# Altium project Master_uC_PCB.PrjPcb (part 2 of 2)

## Sheet [5]Cooling_Control.SchDoc
size A4; SheetNumber: 6; SheetTotal: 6
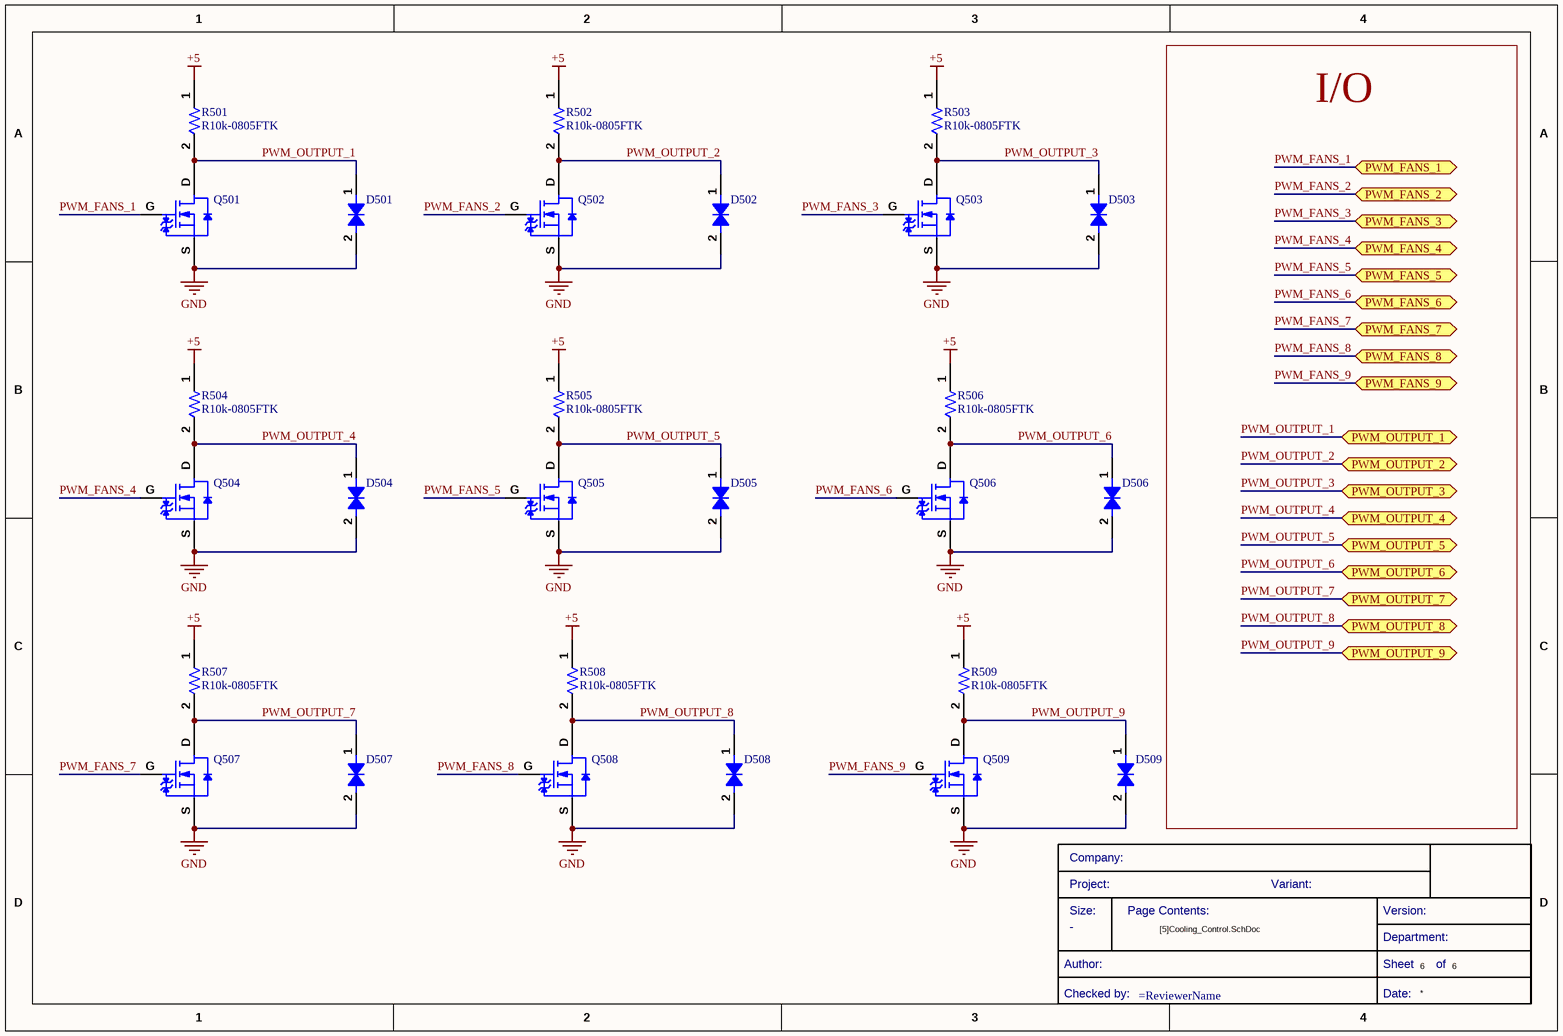
[diagram p4: [5]Cooling_Control.SchDoc]

### Parts
(Parts that share a designator on the sheet are numbered #1, #2 ... from top to bottom, then left to right.)
?#5  (no value)  (graphical)
D501  DTVS-13V-DO-214AC  [DTVS-DO-214AC]  (value not drawn)
D502  DTVS-13V-DO-214AC  [DTVS-DO-214AC]  (value not drawn)
D503  DTVS-13V-DO-214AC  [DTVS-DO-214AC]  (value not drawn)
D504  DTVS-13V-DO-214AC  [DTVS-DO-214AC]  (value not drawn)
D505  DTVS-13V-DO-214AC  [DTVS-DO-214AC]  (value not drawn)
D506  DTVS-13V-DO-214AC  [DTVS-DO-214AC]  (value not drawn)
D507  DTVS-13V-DO-214AC  [DTVS-DO-214AC]  (value not drawn)
D508  DTVS-13V-DO-214AC  [DTVS-DO-214AC]  (value not drawn)
D509  DTVS-13V-DO-214AC  [DTVS-DO-214AC]  (value not drawn)
Q501  SQ2318CES-T1_GE3  [SOT95P245X110-3N]  (value not drawn)
Q502  SQ2318CES-T1_GE3  [SOT95P245X110-3N]  (value not drawn)
Q503  SQ2318CES-T1_GE3  [SOT95P245X110-3N]  (value not drawn)
Q504  SQ2318CES-T1_GE3  [SOT95P245X110-3N]  (value not drawn)
Q505  SQ2318CES-T1_GE3  [SOT95P245X110-3N]  (value not drawn)
Q506  SQ2318CES-T1_GE3  [SOT95P245X110-3N]  (value not drawn)
Q507  SQ2318CES-T1_GE3  [SOT95P245X110-3N]  (value not drawn)
Q508  SQ2318CES-T1_GE3  [SOT95P245X110-3N]  (value not drawn)
Q509  SQ2318CES-T1_GE3  [SOT95P245X110-3N]  (value not drawn)
R501  R10k-0805FTK  [R0805FTK]
R502  R10k-0805FTK  [R0805FTK]
R503  R10k-0805FTK  [R0805FTK]
R504  R10k-0805FTK  [R0805FTK]
R505  R10k-0805FTK  [R0805FTK]
R506  R10k-0805FTK  [R0805FTK]
R507  R10k-0805FTK  [R0805FTK]
R508  R10k-0805FTK  [R0805FTK]
R509  R10k-0805FTK  [R0805FTK]

### Ports
PWM_FANS_1 (bidir, see Master_uC_PCB.SchDoc[1C], [2]STM32L4[3A]), PWM_FANS_2 (bidir, see Master_uC_PCB.SchDoc[1C], [2]STM32L4[3A]), PWM_FANS_3 (bidir, see Master_uC_PCB.SchDoc[1C], [2]STM32L4[3A]), PWM_FANS_4 (bidir, see Master_uC_PCB.SchDoc[1C], [2]STM32L4[3B]), PWM_FANS_5 (bidir, see Master_uC_PCB.SchDoc[1C], [2]STM32L4[3B]), PWM_FANS_6 (bidir, see Master_uC_PCB.SchDoc[1C], [2]STM32L4[3B]), PWM_FANS_7 (bidir, see Master_uC_PCB.SchDoc[1C], [2]STM32L4[3B]), PWM_FANS_8 (bidir, see Master_uC_PCB.SchDoc[1C], [2]STM32L4[3B]), PWM_FANS_9 (bidir, see Master_uC_PCB.SchDoc[1C], [2]STM32L4[3B]), PWM_OUTPUT_1 (bidir, see Master_uC_PCB.SchDoc[1C]), PWM_OUTPUT_2 (bidir, see Master_uC_PCB.SchDoc[1C]), PWM_OUTPUT_3 (bidir, see Master_uC_PCB.SchDoc[1C]), PWM_OUTPUT_4 (bidir, see Master_uC_PCB.SchDoc[1C]), PWM_OUTPUT_5 (bidir, see Master_uC_PCB.SchDoc[1C]), PWM_OUTPUT_6 (bidir, see Master_uC_PCB.SchDoc[1C]), PWM_OUTPUT_7 (bidir, see Master_uC_PCB.SchDoc[1C]), PWM_OUTPUT_8 (bidir, see Master_uC_PCB.SchDoc[1C]), PWM_OUTPUT_9 (bidir, see Master_uC_PCB.SchDoc[1C])

### Nets
+5: R501.1 R502.1 R503.1 R504.1 R505.1 R506.1 R507.1 R508.1 R509.1
GND: D501.2 D502.2 D503.2 D504.2 D505.2 D506.2 D507.2 D508.2 D509.2 Q501.S Q502.S Q503.S Q504.S Q505.S Q506.S Q507.S Q508.S Q509.S
PWM_FANS_1: Q501.G ; port PWM_FANS_1
PWM_FANS_2: Q502.G ; port PWM_FANS_2
PWM_FANS_3: Q503.G ; port PWM_FANS_3
PWM_FANS_4: Q504.G ; port PWM_FANS_4
PWM_FANS_5: Q505.G ; port PWM_FANS_5
PWM_FANS_6: Q506.G ; port PWM_FANS_6
PWM_FANS_7: Q507.G ; port PWM_FANS_7
PWM_FANS_8: Q508.G ; port PWM_FANS_8
PWM_FANS_9: Q509.G ; port PWM_FANS_9
PWM_OUTPUT_1: D501.1 Q501.D R501.2 ; port PWM_OUTPUT_1
PWM_OUTPUT_2: D502.1 Q502.D R502.2 ; port PWM_OUTPUT_2
PWM_OUTPUT_3: D503.1 Q503.D R503.2 ; port PWM_OUTPUT_3
PWM_OUTPUT_4: D504.1 Q504.D R504.2 ; port PWM_OUTPUT_4
PWM_OUTPUT_5: D505.1 Q505.D R505.2 ; port PWM_OUTPUT_5
PWM_OUTPUT_6: D506.1 Q506.D R506.2 ; port PWM_OUTPUT_6
PWM_OUTPUT_7: D507.1 Q507.D R507.2 ; port PWM_OUTPUT_7
PWM_OUTPUT_8: D508.1 Q508.D R508.2 ; port PWM_OUTPUT_8
PWM_OUTPUT_9: D509.1 Q509.D R509.2 ; port PWM_OUTPUT_9

### Notes on the sheet
- I/O
- Size:
- Company:
- Project:
- Page Contents:
- Variant:
- Version:
- Checked by:
- Author:
- Sheet
- Date:
- Department:
- of

### Library data of the parts
?#5 = CMP-00043-6: Standard Title Block
D501-D509 = CMP-00155-1: Tvs Diode, 400W, 13V, Bidir, DO-214AC; Manufacturer Part Number: 824501131; Manufacturer: Wurth Electronics; Peak Pulse Current: 18.6A; Power Line Protection: No; .Creator: DO; Forward Voltage: 15.15V; Polarity: Bidirectional; Number of Bidirectional Channels: 1; Clamping Voltage: 21.5V; Max Operating Temperature: 150°C; Category: TVS Diodes; Stock 1: 1000; RoHS: Yes; ComponentLink3Description: Where buy it; Source: Filter components.SchLib; Design Item ID: DTVS-13V-DO-214AC; REACH SVHC: Unknown; Min Operating Temperature: -65°C; Resistor Type: Zener; ComponentLink2Description: http://www.farnell.com/datasheets/2036399.pdf?src-supplier=Element14; Peak Pulse Power: 400W; ComponentLink1URL: https://katalog.we-online.de/pbs/datasheet/824501131.pdf?src-supplier=Digi-Key; Packaging: Cut Tape; ComponentLink2URL: http://www.farnell.com/datasheets/2036399.pdf?src-supplier=Element14; ComponentLink3URL: https://www.we-online.com/catalog/en/WE-TVSP?sq=824501131#824501131; RoHS Compliant: Yes; Reverse Standoff Voltage: 13V; Mount: Surface Mount; Min Breakdown Voltage: 15.15V; ComponentLink1Description: https://katalog.we-online.de/pbs/datasheet/824501131.pdf?src-supplier=Digi-Key; Pricing 1: 1=0,27000 (USD); Pins: 2
Q501-Q509 = CMP-013-00002-1: Mosfet, N-channel, 40V, 7A, SOT-23 Rohs Compliant: Yes
R501-R509 = CMP-00085-1: BOURNS         CR0805-JW-103ELF            Surface Mount Chip Resistor, Thick Film, CR Series, 10 kohm, 125 mW,  5%, 150 V; .Creator: DR; Power Rating: 125mW; Voltage Rating (DC): 100V; Voltage Rating: 150V; Temperature Coefficient: 200ppm/°C; Value: 10k; ComponentLink6URL: https://datasheet.ciiva.com/16783/70154685-16783482.pdf?src-supplier=Allied+Electronics; Manufacturer 1: Bourns; Package Quantity: 1; ComponentLink10URL: https://datasheet.ciiva.com/7985/1856384-7985869.pdf?src-supplier=Element14; Technology: THICK FILM; Source: Passives.SchLib; RoHS Compliant: Yes; ComponentLink10Description: https://datasheet.ciiva.com/7985/1856384-7985869.pdf?src-supplier=Element14; ComponentLink1URL: https://datasheet.ciiva.com/11821/0900766b80fcdb72-11821135.pdf?src-supplier=RSComponents; ComponentLink7Description: https://datasheet.ciiva.com/5548/chpreztr-5548491.pdf?src-supplier=Mouser; Radiation Hardening: No; Design Item ID: R10k-0805FTK; ComponentLink4Description: https://datasheet.ciiva.com/7986/691949-7986187.pdf?src-supplier=Element14; Pins: 2; ComponentLink9URL: https://datasheet.ciiva.com/6559/chpreztr-6559901.pdf?src-supplier=Digi-Key; Resistor Type: Thick Film; ComponentLink4URL: https://datasheet.ciiva.com/7986/691949-7986187.pdf?src-supplier=Element14; Contact Plating: Tin; Case Code (Metric): 2012; Military Standard: Not; Depth: 1.25mm; Case/Package: 0805; Packaging: Tape and Reel; ComponentLink9Description: https://datasheet.ciiva.com/6559/chpreztr-6559901.pdf?src-supplier=Digi-Key; Construction: Rectangular; Pricing 1: 1=0,05790, 10=0,01540, 25=0,01340, 100=0,00340 (USD); ComponentLink7URL: https://datasheet.ciiva.com/5548/chpreztr-5548491.pdf?src-supplier=Mouser; Category: Chip SMD Resistors; Length: 2mm; Max Operating Temperature: 155°C; Resistance Tolerance: 5%; Manufacturer Part Number 1: CR0805-JW-103ELF; Height: 0.5mm; ComponentLink2URL: https://datasheet.ciiva.com/9122/chpreztr-9122374.pdf?src-supplier=Avnet; Thickness: 508um; Max Power Dissipation: 125mW; ComponentLink8Description: https://datasheet.ciiva.com/6559/chpreztr-6559900.pdf?src-supplier=Digi-Key; REACH SVHC: No SVHC; ComponentLink8URL: https://datasheet.ciiva.com/6559/chpreztr-6559900.pdf?src-supplier=Digi-Key; ComponentLink5URL: https://datasheet.ciiva.com/30065/159chpreztr-30065976.pdf?src-supplier=Onlinecomponents.com; Width: 1.25mm; ComponentLink11URL: https://datasheet.ciiva.com/48692/001055517-da-01-en-smd-wid-cr0805-jw-103elf-10k-ohm-1-8w-48692118.pdf?src-supplier=Conrad; ComponentLink3Description: https://datasheet.ciiva.com/22693/1902866-22693254.pdf?src-supplier=Element14; ComponentLink11Description: https://datasheet.ciiva.com/48692/001055517-da-01-en-smd-wid-cr0805-jw-103elf-10k-ohm-1-8w-48692118.pdf?src-supplier=Conrad; ComponentLink1Description: https://datasheet.ciiva.com/11821/0900766b80fcdb72-11821135.pdf?src-supplier=RSComponents; ComponentLink2Description: https://datasheet.ciiva.com/9122/chpreztr-9122374.pdf?src-supplier=Avnet; Stock 1: 57566; Min Operating Temperature: -55°C; Series: CR0805; Number of Terminations: 2; Termination: SMD/SMT; Tolerance: 5%; Mount: Surface Mount; ComponentLink6Description: https://datasheet.ciiva.com/16783/70154685-16783482.pdf?src-supplier=Allied+Electronics; ComponentLink5Description: https://datasheet.ciiva.com/30065/159chpreztr-30065976.pdf?src-supplier=Onlinecomponents.com; RoHS: Yes; Features: Moisture Resistant; ComponentLink3URL: https://datasheet.ciiva.com/22693/1902866-22693254.pdf?src-supplier=Element14

## Nets that join several sheets
+3V3: [1]Supply (C*#5.2 R*#1.2 U?.2 U?.4), [2]STM32L4 (14 pins), [3]CAN_Communication (C301.1 U301.11), [4]isoSPI (U401.1 U401.6 U401.25 U401.30)
+5: [1]Supply (C*#3.2 C*#4.2 DCDC*.3 U?.3), [4]isoSPI (6 pins), [5]Cooling_Control (9 pins)
GND: [1]Supply (7 pins), [2]STM32L4 (19 pins), [3]CAN_Communication (15 pins), [4]isoSPI (8 pins), [5]Cooling_Control (18 pins)
CAN1_RX: [2]STM32L4 (U201.70), [3]CAN_Communication (U301.4)
CAN1_TX: [2]STM32L4 (U201.71), [3]CAN_Communication (U301.1)
CAN2_RX: [2]STM32L4 (U201.51), [3]CAN_Communication (U301.7)
CAN2_TX: [2]STM32L4 (U201.52), [3]CAN_Communication (U301.6)
PWM_FANS_1: [2]STM32L4 (U201.15), [5]Cooling_Control (Q501.G)
PWM_FANS_2: [2]STM32L4 (U201.16), [5]Cooling_Control (Q502.G)
PWM_FANS_3: [2]STM32L4 (U201.17), [5]Cooling_Control (Q503.G)
PWM_FANS_4: [2]STM32L4 (U201.18), [5]Cooling_Control (Q504.G)
PWM_FANS_5: [2]STM32L4 (U201.33), [5]Cooling_Control (Q505.G)
PWM_FANS_6: [2]STM32L4 (U201.34), [5]Cooling_Control (Q506.G)
PWM_FANS_7: [2]STM32L4 (U201.63), [5]Cooling_Control (Q507.G)
PWM_FANS_8: [2]STM32L4 (U201.64), [5]Cooling_Control (Q508.G)
PWM_FANS_9: [2]STM32L4 (U201.65), [5]Cooling_Control (Q509.G)
SPI1_CS: [2]STM32L4 (U201.67), [4]isoSPI (U401.5)
SPI1_PICO: [2]STM32L4 (U201.32), [4]isoSPI (U401.2)
SPI1_POCI: [2]STM32L4 (U201.31), [4]isoSPI (U401.3)
SPI1_SCK: [2]STM32L4 (U201.30), [4]isoSPI (U401.4)
SPI2_PICO: [2]STM32L4 (U201.54), [4]isoSPI (U401.26)
SPI2_POCI: [2]STM32L4 (U201.53), [4]isoSPI (U401.27)
SPI2_SCK: [2]STM32L4 (U201.47), [4]isoSPI (U401.28)
SPI12_CS: [2]STM32L4 (U201.48), [4]isoSPI (U401.29)